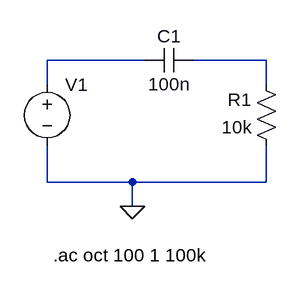
[diagram p0: schematic RC-passaalto.asc]
RC-passaalto.asc, the LTspice schematic file:
Version 4
SHEET 1 880 680
WIRE 192 224 64 224
WIRE 352 224 256 224
WIRE 64 256 64 224
WIRE 352 256 352 224
WIRE 64 384 64 336
WIRE 176 384 64 384
WIRE 352 384 352 336
WIRE 352 384 176 384
WIRE 176 416 176 384
FLAG 176 416 0
SYMBOL res 368 352 R180
WINDOW 0 36 76 Left 2
WINDOW 3 36 40 Left 2
SYMATTR InstName R1
SYMATTR Value 10k
SYMBOL cap 256 208 R90
WINDOW 0 0 32 VBottom 2
WINDOW 3 32 32 VTop 2
SYMATTR InstName C1
SYMATTR Value 100n
SYMBOL voltage 64 240 R0
SYMATTR InstName V1
SYMATTR Value ""
SYMATTR Value2 AC 1
TEXT 72 480 Left 2 !.ac oct 100 1 100k

The netlist it stands for:
* RC-passaalto.asc
R1 0 N002 10k
C1 N002 N001 100n
V1 N001 0 AC 1
.ac oct 100 1 100k
.backanno
.end